# EAGLE design GK_Roland_Breakout (EAGLE 7.6.0)
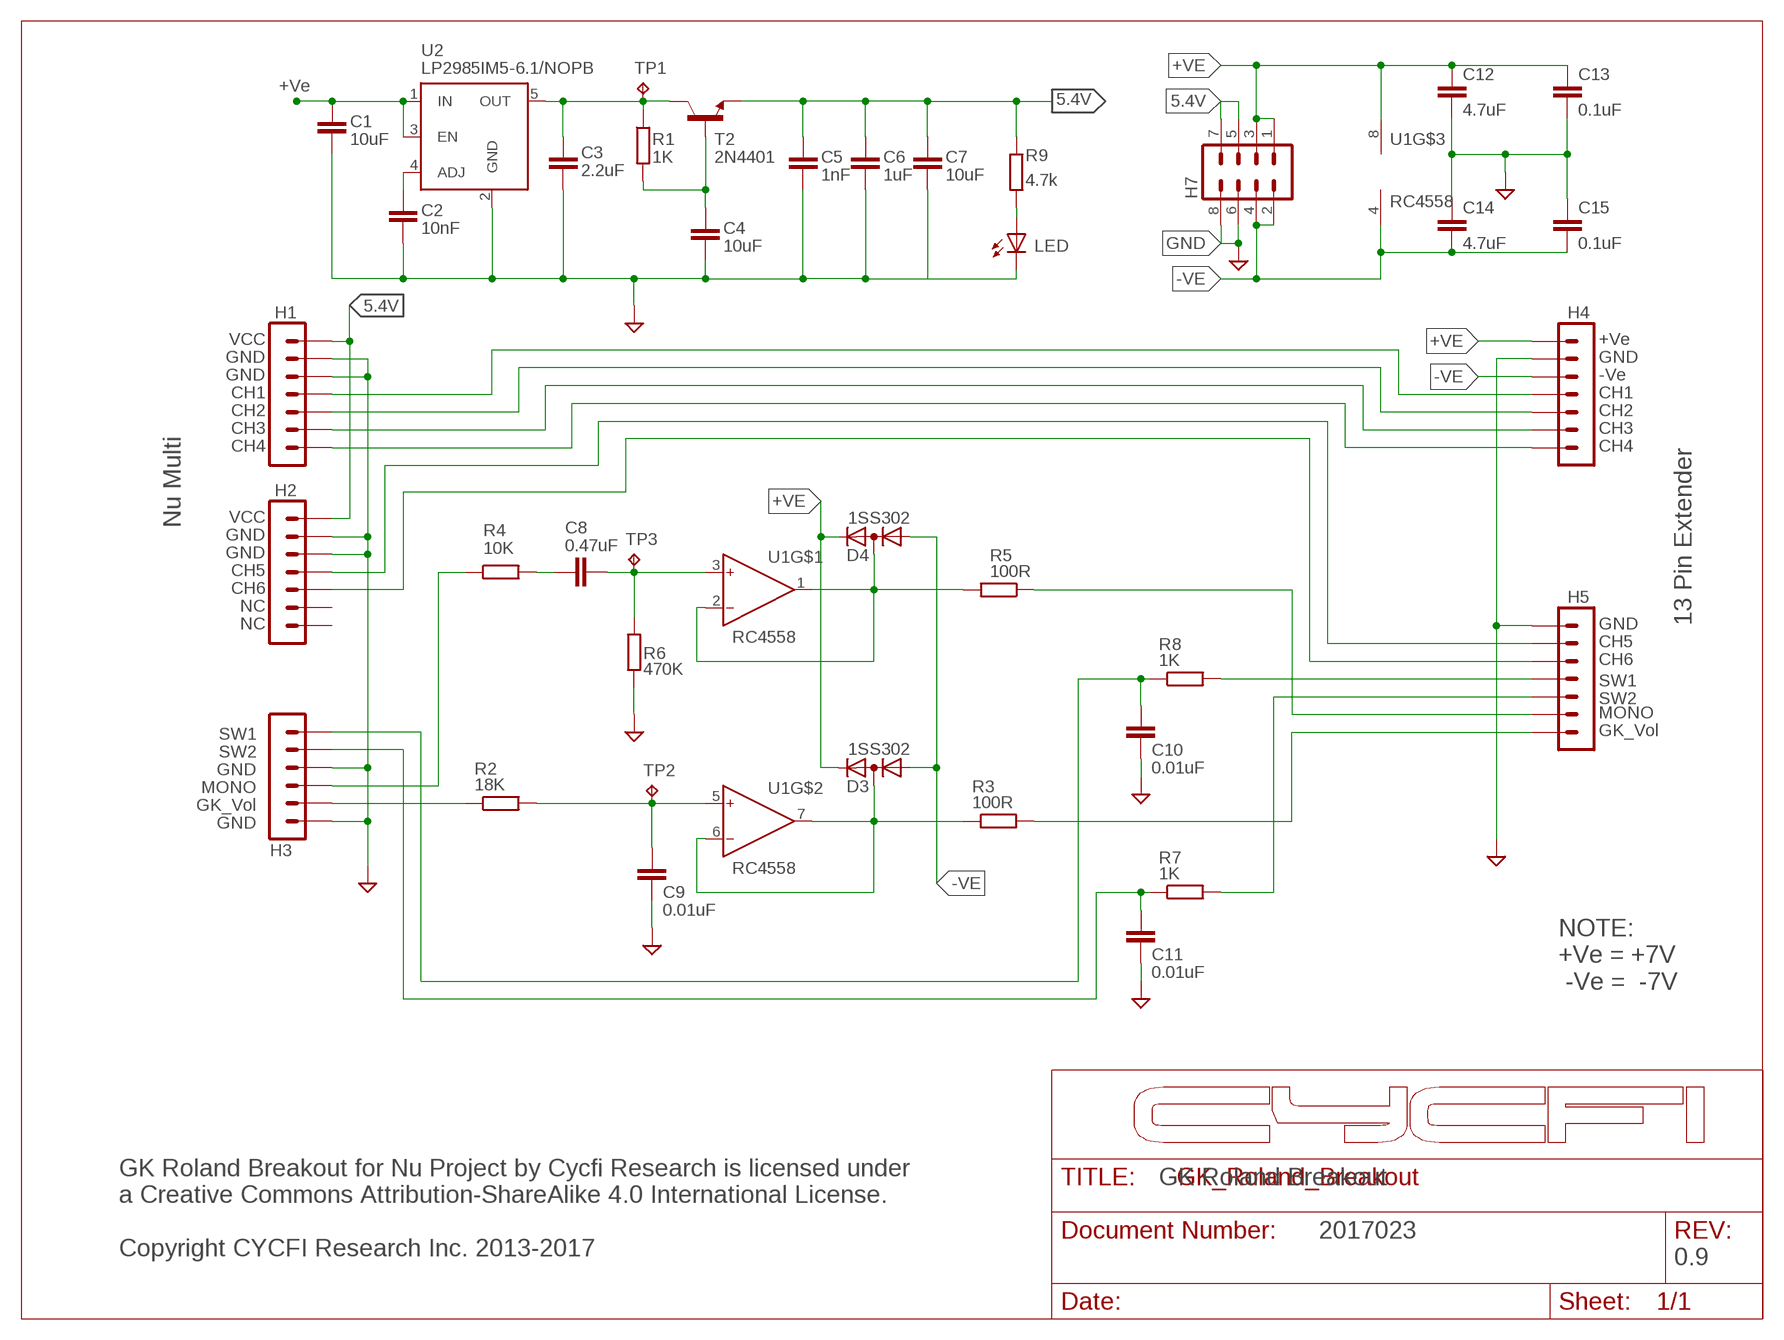
[diagram p0: schematic, sheet 1]

## Parts
C1  10uF  C-EUC0805  [C0805]
C2  10nF  C-EUC0805  [C0805]
C3  2.2uF  C-EUC0805  [C0805]
C4  10uF  C-EUC0805  [C0805]
C5  1nF  C-EUC0603  [C0603]
C6  1uF  C-EUC0603  [C0603]
C7  10uF  C-EUC0805  [C0805]
C8  0.47uF  C-EUC0603  [C0603]
C9  0.01uF  C-EUC0805  [C0805]
C10  0.01uF  C-EUC0805  [C0805]
C11  0.01uF  C-EUC0805  [C0805]
C12  4.7uF  C-EUC0805  [C0805]
C13  0.1uF  C-EUC0805  [C0805]
C14  4.7uF  C-EUC0805  [C0805]
C15  0.1uF  C-EUC0805  [C0805]
D3  1SS302  [SC70-3]
D4  1SS302  [SC70-3]
H1  7P_ZIF_59453-071110EDHLF  [7P_ZIF_59453-071110EDHLF]
H2  7P_ZIF_59453-071110EDHLF  [7P_ZIF_59453-071110EDHLF]
H3  6P-2.54-TH  [6P-2.54-TH]
H4  7P_ZIF_59453-071110EDHLF  [7P_ZIF_59453-071110EDHLF]
H5  7P_ZIF_59453-071110EDHLF  [7P_ZIF_59453-071110EDHLF]
H7  MA04-2  [MA04-2]
LED  LED3MM  [LED3MM]
R1  1K  R-EU_R0402  [R0402]
R2  18K  R-EU_R0402  [R0402]
R3  100R  R-EU_R0402  [R0402]
R4  10K  R-EU_R0402  [R0402]
R5  100R  R-EU_R0402  [R0402]
R6  470K  R-EU_R0402  [R0402]
R7  1K  R-EU_R0402  [R0402]
R8  1K  R-EU_R0402  [R0402]
R9  4.7k  R-EU_R0402  [R0402]
T2  2N4401  TRAN-MMBT2222A  [SOT23-3]
TP1  TPB1,27  [B1,27]
TP2  TPB1,27  [B1,27]
TP3  TPB1,27  [B1,27]
U1  RC4558  [SOIC-8]
U2  MIC5205-5V  MIC5219BM5  [SOT23-5]

## Nets
5.4V: C5.1 C6.1 C7.1 H1.P$1 H2.P$1 H7.5 H7.7 R9.1 T2.2(E)
+VE: C1.1 C12.1 C13.1 D3.2(K) D4.2(K) H4.P$1 H7.1 H7.3 U1.8(V+) U2.1(IN) U2.3(EN)
-VE: C14.2 C15.2 D3.1(A) D4.1(A) H4.P$3 H7.2 H7.4 U1.4(V-)
GND: C1.2 C2.2 C3.2 C4.2 C5.2 C6.2 C7.2 C9.2 C10.2 C11.2 C12.2 C13.2 C14.1 C15.1 H1.P$2 H1.P$3 H2.P$2 H2.P$3 H3.3 H3.6 H4.P$2 H5.P$1 H7.6 H7.8 LED.K(C) R6.2 U2.2(GND)
N$1: C4.1 R1.2 T2.1(B)
N$2: LED.A R9.2
N$3: C2.1 U2.4(ADJ)
N$5: H1.P$4 H4.P$4
N$6: H1.P$5 H4.P$5
N$7: H1.P$6 H4.P$6
N$8: H1.P$7 H4.P$7
N$9: H5.P$6 R5.1
N$10: H2.P$4 H5.P$2
N$11: D3.3(AK) R3.1 U1.6(IN-) U1.7(OUT)
N$12: C9.1 R2.2 TP2.TP U1.5(IN+)
N$13: H5.P$7 R3.2
N$14: C8.2 R4.2
N$15: C8.1 R6.1 TP3.TP U1.3(IN+)
N$16: D4.3(AK) R5.2 U1.1(OUT) U1.2(IN-)
N$18: H2.P$5 H5.P$3
N$19: C10.1 H3.1 R8.1
N$20: C11.1 H3.2 R7.1
N$23: H3.4 R4.1
N$24: H3.5 R2.1
N$25: H5.P$5 R7.2
N$26: H5.P$4 R8.2
NC1: C3.1 R1.1 T2.3(C) TP1.TP U2.5(OUT)
Unconnected: H2.P$6 H2.P$7

## Notes on the sheet
- LP2985IM5-6.1/NOPB
- +Ve
- VCC | +Ve
- GND | GND
- GND | -Ve
- CH1 | CH1
- CH2 | CH2
- CH3 | CH3
- CH4 | CH4
- Nu Multi | VCC
- GND
- GND
- CH5
- CH6
- NC
- NC | GND | 13 Pin Extender
- CH5
- CH6
- SW1
- SW2
- MONO
- SW1
- GK_Vol
- SW2
- GND
- MONO
- GK_Vol
- GND
- NOTE:
  +Ve = +7V
   -Ve =  -7V
- GK Roland Breakout
- 2017023
- GK Roland Breakout for Nu Project by Cycfi Research is licensed under 
  a Creative Commons Attribution-ShareAlike 4.0 International License.
  
  Copyright CYCFI Research Inc. 2013-2017
- 0.9

## Library data of the parts
C1-C15 = resistor:C-EU: CAPACITOR, European symbol
D3 D4 = CYCFI_semicon:1SS302
H1 H2 H4 H5 = CYCFI_Con:7P_ZIF_59453-071110EDHLF
H3 = CYCFI_Con:6P-2.54-TH
H7 = con-lstb:MA04-2: PIN HEADER; OC_FARNELL: unknown; OC_NEWARK: unknown
LED = led:LED: LED OSRAM: - CHIPLED LG R971, LG N971, LY N971, LG Q971, LY Q971, LO R971, LY R971 LH N974, LH R974 LS Q976, LO Q976, LY Q976 LO Q996 - Hyper CHIPLED LW Q18S LB Q993, LB Q99A, LB R99A - SideLED LS A670, LO A670, LY A670, LG A670, LP A670 LB A673, LV A673, LT A673, LW A673 LH A674 LY A675 LS A676, LA A676, LO A676, LY A676, LW A676 LS A679, LY A679, LG A679 - Hyper Micro SIDELED® LS Y876, LA Y876, LO Y876, LY Y876 LT Y87S - SmartLED LW L88C, LW L88S LB L89C, LB L89S, LG L890 LS L89K, LO L89K, LY L89K LS L896, LA L896, LO L896, LY L896 - TOPLED LS T670, LO T670, LY T670, LG T670, LP T670 LSG T670, LSP T670, LSY T670, LOP T670, LYG T670 LG T671, LOG T671, LSG T671 LB T673, LV T673, LT T673, LW T673 LH T674 LS T676, LA T676, LO T676, LY T676, LB T676, LH T676, LSB T676, LW T676 LB T67C, LV T67C, LT T67C, LS T67K, LO T67K, LY T67K, LW E67C LS E67B, LA E67B, LO E67B, LY E67B, LB E67C, LV E67C, LT E67C LW T67C LS T679, LY T679, LG T679 LS T770, LO T770, LY T770, LG T770, LP T770 LB T773, LV T773, LT T773, LW T773 LH T774 LS E675, LA E675, LY E675, LS T675 LS T776, LA T776, LO T776, LY T776, LB T776 LHGB T686 LT T68C, LB T68C - Hyper Mini TOPLED® LB M676 - Mini TOPLED Santana® LG M470 LS M47K, LO M47K, LY M47K Source: http://www.osram.convergy.de LUXEON: - LUMILED® LXK2-PW12-R00, LXK2-PW12-S00, LXK2-PW14-U00, LXK2-PW14-V00 LXK2-PM12-R00, LXK2-PM12-S00, LXK2-PM14-U00 LXK2-PE12-Q00, LXK2-PE12-R00, LXK2-PE12-S00, LXK2-PE14-T00, LXK2-PE14-U00 LXK2-PB12-K00, LXK2-PB12-L00, LXK2-PB12-M00, LXK2-PB14-N00, LXK2-PB14-P00, LXK2-PB14-Q00 LXK2-PR12-L00, LXK2-PR12-M00, LXK2-PR14-Q00, LXK2-PR14-R00 LXK2-PD12-Q00, LXK2-PD12-R00, LXK2-PD12-S00 LXK2-PH12-R00, LXK2-PH12-S00 LXK2-PL12-P00, LXK2-PL12-Q00, LXK2-PL12-R00 Source: www.luxeon.com KINGBRIGHT: KA-3528ASYC Source: www.kingbright.com
R1-R9 = resistor:R-EU_: RESISTOR, European symbol
T2 = Cycfi:TRAN-MMBT2222A
TP1-TP3 = testpad:TP: Test pad
U1 = CYCFI_semicon:RC4558
U2 = v-reg-micrel:MIC5219BM5: VOLTAGE REGULATOR; MF: ALTERA CORPORATION; MPN: MIC5219BM5 TR; OC_FARNELL: 1100656; OC_NEWARK: 09J8939

## Board
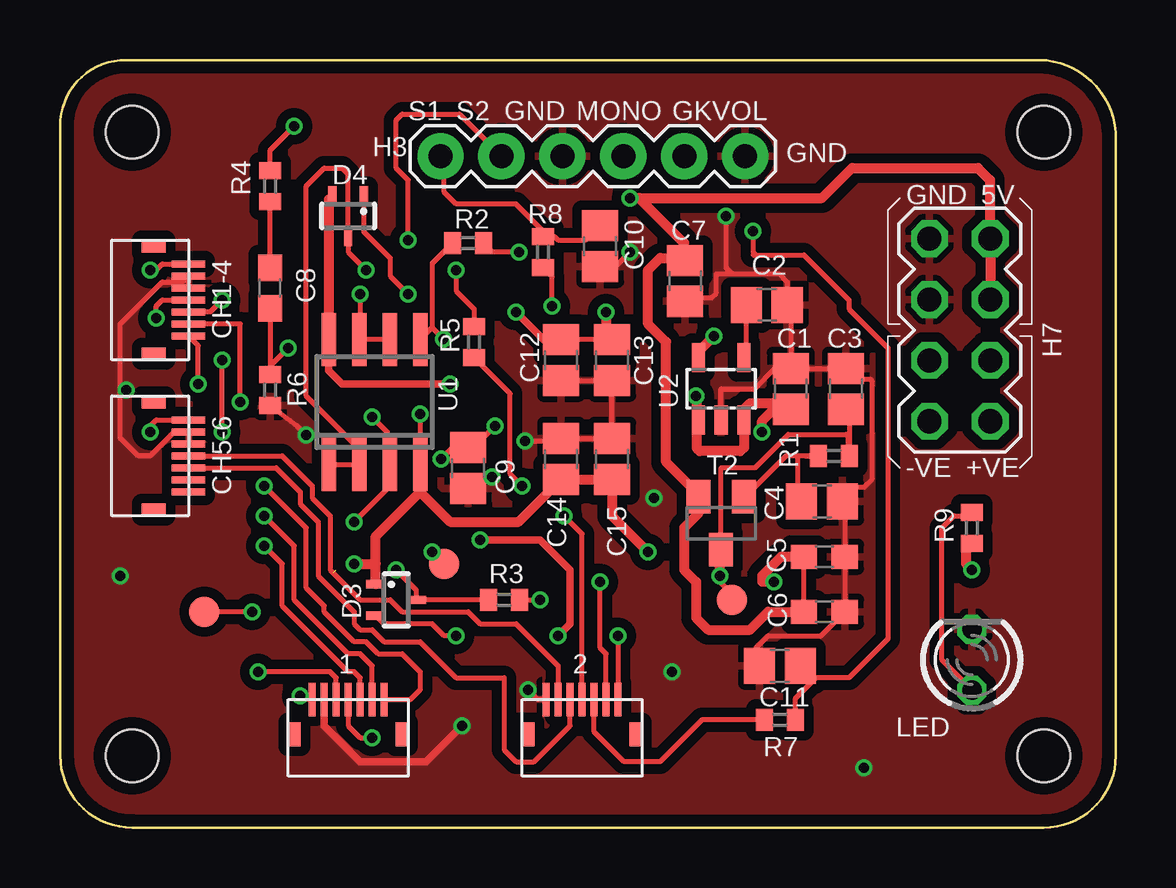
[diagram p1: board, top side]
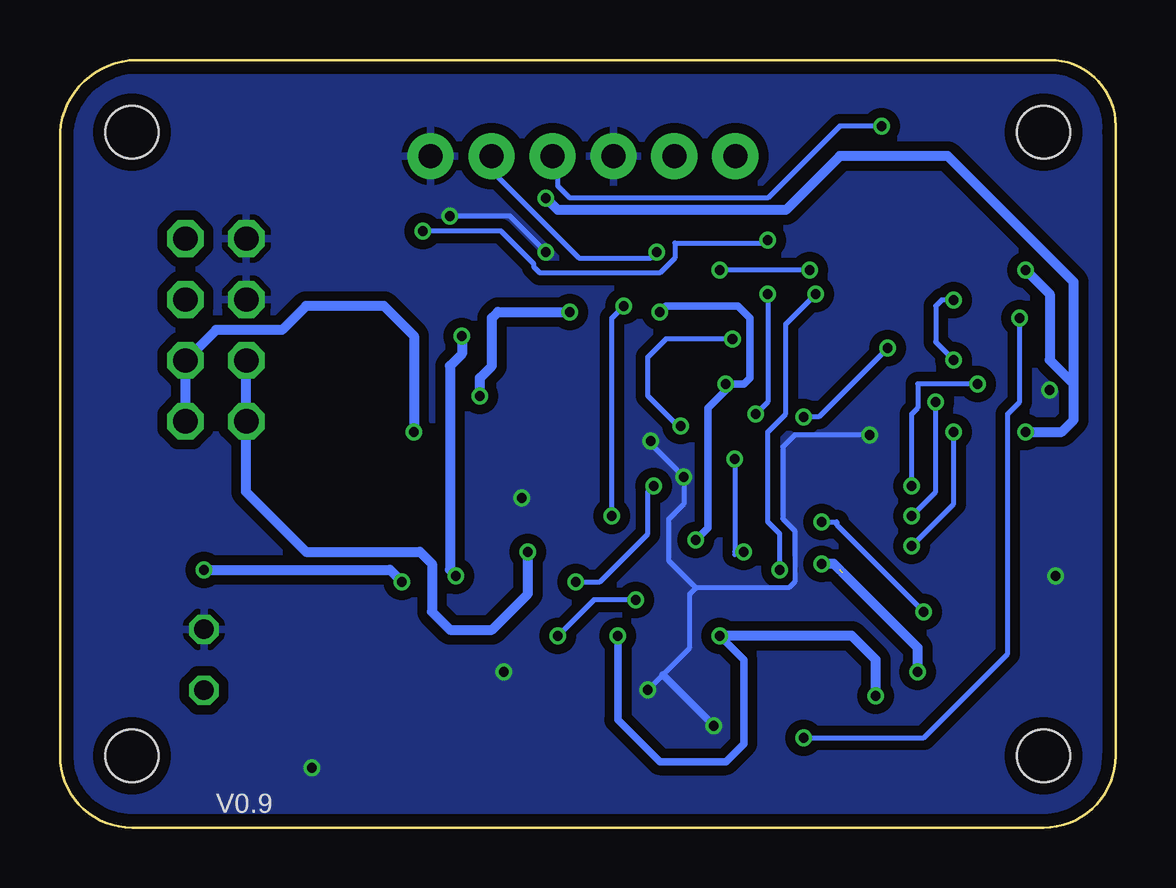
[diagram p2: board, bottom side, seen from below]

Size 44.01 x 32.01 mm. Coordinates in mm from the lower left corner, seen from the top.
Outline: 0.01,29 0.01,3 arc90 3.01,0 41.01,0 arc90 44.01,3 44.01,29 arc90 40.51,32 2.51,32 arc90 0.01,29
Copper layers (1*16): Top 0.035mm / dielectric 1.6mm / Bottom 0.035mm
Design rules "Elecrow_2-layer_PCB_eagle_rule": minimum track width 6mil, minimum drill 12mil, track to track 6mil, track to pad 8mil, pad to pad 12mil, via to via 12mil, smd to smd 0mil, copper to edge 20mil, drill to drill 10mil, minimum pad ring 6mil, minimum via ring 6mil, stop-mask expansion 0mil, vias tented up to drill 100mil, thermal gap 10mil
Holes 2.2 mm at 3.01,29 3.01,3 41.01,3 41.01,29

### Footprints (pad centres in the part's own frame; a part is rotated, then mirrored left to right if it is on the bottom)
C0805 = smd 1.3 x 1.5: 1 -0.85,0; 2 0.85,0
C0603 = smd 1.1 x 1: 1 -0.85,0; 2 0.85,0
SC70-3 = smd 0.35 x 0.8: 1 -0.65,-0.85; 2 0.65,-0.85; 3 0,0.85
7P_ZIF_59453-071110EDHLF = smd 0.3 x 1.4: P$1 -1.5,1.6; P$2 -1,1.6; P$3 -0.5,1.6; P$4 0,1.6; P$5 0.5,1.6; P$6 1,1.6; P$7 1.5,1.6 | smd 0.52 x 1: ST1 -2.24,0.15; ST2 2.24,0.15
6P-2.54-TH = drill 1 pad 1.93: 1 -6.35,0; 2 -3.81,0; 3 -1.27,0; 4 1.27,0; 5 3.81,0; 6 6.35,0
MA04-2 = drill 1.016 octagon: 1 -3.81,-1.27; 2 -3.81,1.27; 3 -1.27,-1.27; 4 -1.27,1.27; 5 1.27,-1.27; 6 1.27,1.27; 7 3.81,-1.27; 8 3.81,1.27
LED3MM = drill 0.813 octagon: A -1.27,0; K 1.27,0
R0402 = smd 0.7 x 0.9: 1 -0.65,0; 2 0.65,0
SOT23-3 = smd 1 x 1.4: 1 -0.95,-1.1; 2 0.95,-1.1; 3 0,1.1
B1,27 = smd 1.27 x 1.27: TP 0,0
SOIC-8 = smd 0.6 x 2.2: 1 -1.905,-2.6; 2 -0.635,-2.6; 3 0.635,-2.6; 4 1.905,-2.6; 5 1.905,2.6; 6 0.635,2.6; 7 -0.635,2.6; 8 -1.905,2.6
SOT23-5 = smd 0.55 x 1.2: 1 -0.95,-1.3; 2 0,-1.3; 3 0.95,-1.3; 4 0.95,1.3; 5 -0.95,1.3

### Placement (x,y rotation side)
C1  30.46,18.3 90 top
C2  29.46,21.8 0 top
C3  32.76,18.3 90 top
C4  31.76,13.6 0 top
C5  31.86,11.3 0 top
C6  31.86,9 0 top
C7  26.06,22.8 270 top
C8  8.76,22.5 90 top
C9  17.01,15 270 top
C10  22.51,24.25 270 top
C11  30.01,6.75 180 top
C12  20.89,19.5 270 top
C13  23.01,19.5 270 top
C14  20.89,15.38 270 top
C15  23.01,15.38 270 top
D3  14.01,9.5 270 top
D4  12.01,25.5 180 top
H1  3.76,22 270 top
H2  3.76,15.5 270 top
H3  22.21,28 0 top
H4  12.01,3.75 0 top
H5  21.76,3.75 0 top
H7  37.51,20.75 90 top
LED  38.01,7 90 top
R1  32.26,15.5 180 top
R2  17.01,24.38 180 top
R3  18.51,9.5 0 top
R4  8.76,26.75 270 top
R5  17.26,20.25 90 top
R6  8.76,18.25 270 top
R7  30.01,4.5 180 top
R8  20.14,24 270 top
R9  38.01,12.5 90 top
T2  27.56,12.7 180 top
TP1  28.01,9.5 0 top
TP2  16.01,11 0 top
TP3  6.01,9 0 top
U1  13.11,17.75 0 top
U2  27.56,18.3 0 top

### Tracks (layer width: path | path; a pad name or v marks a point on that pad's centre or on a via)
5.4V  (via drill 0.4)
  Top 0.203: C6.1 C5.1 30.56,11.3 | v3.76,16.5 3.76,16.75 4.01,17 H2.P$1 | 26.01,24.38 26.01,23.7 C7.1 | 37.76,11.6 R9.1 | v3.76,23.25 4.01,23.25 4.26,23.5 H1.P$1
  Top 0.406: 26.01,24.38 24.14,26.25 v23.76,26.25 31.76,26.25 33.01,27.5 38.26,27.5 38.76,27 38.76,24.58 H7.7 H7.5 | C6.1 29.51,9 28.76,8.25 27.01,8.25 26.51,8.75 26.51,10.25 26.01,10.75 26.01,12.5 26.61,13.1 T2.2 26.61,13.9 25.26,15.25 25.26,20.25 24.51,21 24.51,23.25 25.01,23.75 25.96,23.75 C7.1 | 30.56,11.3 30.06,11.3 29.26,10.5 29.26,10.25 v29.76,10.25 | 37.76,11.6 37.76,11 v38.01,10.75
  Bottom 0.406: v23.76,26.25 23.26,25.75 13.76,25.75 11.51,28 7.01,28 1.76,22.75 1.76,18.5 | v38.01,10.75 30.26,10.75 v29.76,10.25 | v3.76,16.5 2.26,16.5 1.76,17 1.76,18.5 | v3.76,23.25 2.76,22.25 2.76,19.5 1.76,18.5
+VE  (via drill 0.4)
  Top 0.203: 11.21,26.2 D4.2 | 23.24,20.12 C13.1 C12.1 | H4.P$1 10.16,5.35 v10.01,5.5 | D3.2 13.51,8.5 15.51,8.5 16.01,8 v16.51,8
  Top 0.305: U1.8 11.21,19.05 11.76,18.5 v16.26,18.5 | v19.01,21.5 20.26,20.25 20.79,20.25 C12.1 | v17.51,12 20.01,12 21.26,10.75 21.26,8.5 v20.76,8
  Top 0.406: 26.56,16.95 26.56,15.8 26.66,15.7 28.36,15.7 28.51,15.85 U2.3 28.51,17.45 28.76,17.7 30.01,17.7 | 26.56,16.95 U2.1 | 30.01,17.7 30.21,17.7 C1.1 | 11.21,26.2 U1.8 | v29.26,16.5 29.26,16.95 30.01,17.7 | 26.56,16.95 26.56,17.95 v26.51,18 | v22.76,21.5 22.76,20.6 C13.1
  Bottom 0.305: v19.01,21.5 18.76,21.75 15.76,21.75 15.26,21.25 15.26,18.75 15.51,18.5 v16.26,18.5 16.26,18.25 17.01,17.5 17.01,12.5 v17.51,12 | v20.76,8 20.76,4.5 19.01,2.75 16.26,2.75 15.51,3.5 15.51,7 v16.51,8
  Bottom 0.406: v29.26,16.5 29.26,20.5 30.51,21.75 33.76,21.75 34.76,20.75 37.51,20.75 H7.3 H7.1 | v10.01,5.5 10.01,7 11.01,8 v16.51,8 | v22.76,21.5 25.76,21.5 26.01,21.25 26.01,19.25 26.51,18.75 v26.51,18
-VE  (via drill 0.4)  (1 unrouted)
  Top 0.203: D4.1 12.66,24.85 13.76,23.75 13.76,23 v14.51,22.25 | v15.01,17.25 U1.4 | U1.4 | D3.1 12.86,10.15 | H4.P$3 11.51,6.25 11.26,6.5 v8.26,6.5 | U1.4
  Top 0.406: v24.51,11.5 23.01,13 C15.2 C14.2 19.11,12.75 16.26,12.75 15.01,14 | D3.1 13.16,11 | 13.16,11 13.16,12.15 15.01,14 | 15.01,14 U1.4 | v12.26,11 13.16,11
  Bottom 0.203: v14.51,22.25 14.51,17.75 v15.01,17.25
  Bottom 0.406: v8.26,6.5 8.26,7.5 11.39,10.62 | H7.4 H7.2 36.24,14 36.26,14 33.76,11.5 29.01,11.5 28.51,11 28.51,9 27.76,8.25 26.01,8.25 24.51,9.75 v24.51,11.5 | 11.51,10.75 11.76,11 v12.26,11
GND  (via drill 0.4)
  Top 0.203: U2.2 27.56,18.3 28.96,18.3 29.81,19.15 C1.2 | C1.2 30.46,21.65 C2.2 30.31,22.75 29.96,23.1 28.01,23.1 | C1.2 C3.2 33.21,18.7 33.76,18.7 33.86,18.6 33.86,14.55 33.51,14.2 33.21,14.2 C4.2 32.71,13.5 C5.2 C6.2 31.71,8 29.51,8 29.01,7.5 C11.2 | C7.2 26.21,22.1 27.16,22.1 27.36,22.3 27.36,23.1 28.01,23.1 | C10.2 23.01,23.25 v23.76,24 23.89,23.88 | v27.76,25.5 27.76,23.35 28.01,23.1 | C9.2 17.76,14.75 17.89,14.75 v18.01,14.62 | R6.2 9.89,16.75 v10.26,16.38 | v19.39,16.12 20.79,16.12 C14.1 C15.1 C13.2 C12.2 | H1.P$3 H1.P$2 5.11,22.75 4.26,22.75 2.51,21 2.51,16.25 3.26,15.5 3.76,15.5 4.76,16.5 H2.P$2 H2.P$3 | H5.P$1 19.91,5.35 v19.51,5.75
  Top 0.305: H4.P$2 11.01,4.25 12.51,2.75 15.26,2.75 v16.76,4.25
  Bottom 0.203: v23.76,24 25.26,25.5 v27.76,25.5 | v10.26,16.38 13.39,16.38 13.89,15.88 13.89,12.88 13.39,12.38 13.39,10.25 13.64,10 17.51,10 | 17.51,10 18.64,11.12 18.64,12.88 18.01,13.5 v18.01,14.62 19.39,16 v19.39,16.12 | v19.51,5.75 18.89,6.38 17.76,7.5 17.76,9.75 17.51,10
  Bottom 0.305: v16.76,4.25 18.89,6.38
  other vias: 25.51,6.5 33.51,2.5 24.76,13.75 2.76,18.25 2.51,10.5
  pour Top (isolate 0.406): 0.01,32 0.01,0 44.01,0 44.01,32
  pour Bottom (isolate 0.406): 0.01,32 0.01,0 44.01,0 44.01,32
N$1
  Top 0.203: C4.1 30.76,13.75 30.76,15.5 | 31.06,15.5 R1.2 30.76,15.5 | 30.76,15.5 30.26,15.5 28.56,13.8 T2.1
N$2
  Top 0.203: LED.A 38.01,5.75 36.76,7 36.76,12.5 37.26,13 37.86,13 R9.2
N$3
  Top 0.203: U2.4 28.61,19.7 C2.1
N$5  (via drill 0.4)
  Top 0.203: H4.P$4 12.01,4.25 12.51,3.75 v13.01,3.75 | v4.01,21.25 4.01,21.75 4.26,22 H1.P$4
  Bottom 0.203: v13.01,3.75 8.01,3.75 4.51,7.25 4.51,17.25 4.01,17.75 v4.01,21.25
N$6  (via drill 0.4)
  Top 0.203: H4.P$5 12.51,6.25 12.26,6.5 12.01,6.5 9.26,9.25 9.26,11 v8.51,11.75 | v6.76,16.5 v6.76,19.5 | v6.76,22 6.26,21.5 H1.P$5
  Bottom 0.203: v8.51,11.75 6.76,13.5 v6.76,16.5 | v6.76,19.5 7.51,20.25 7.51,21.75 7.26,22 v6.76,22
N$7  (via drill 0.4)
  Top 0.203: v8.51,13 9.76,11.75 9.76,9.5 12.01,7.25 12.51,7.25 13.01,6.75 H4.P$6 | v7.51,17.75 7.51,21 H1.P$6
  Bottom 0.203: v8.51,13 7.51,14 v7.51,17.75
N$8  (via drill 0.4)
  Top 0.203: v8.51,14.25 10.26,12.5 10.26,10 11.01,9.25 11.01,9 12.26,7.75 12.76,7.75 13.26,7.25 14.26,7.25 15.01,6.5 15.01,5.75 14.61,5.35 H4.P$7 | v5.76,18.5 5.76,20.1 H1.P$7
  Bottom 0.203: v8.51,14.25 8.51,17.25 8.26,17.5 8.26,18.5 v5.76,18.5
N$9  (via drill 0.4)
  Top 0.203: H5.P$6 22.76,7.25 22.51,7.5 v22.51,10.25 | v19.26,14.25 18.76,14.75 18.76,18.1 R5.1
  Bottom 0.203: v22.51,10.25 21.51,10.25 19.51,12.25 19.51,14 v19.26,14.25
N$10
  Top 0.203: H2.P$4 9.26,15.5 10.51,14.25 10.51,13.75 11.26,13 11.26,10.75 12.51,9.5 13.76,9.5 14.26,9 17.01,9 17.51,8.5 19.01,8.5 20.76,6.75 H5.P$2
N$11  (via drill 0.4)
  Top 0.203: v14.01,10.75 14.86,9.9 D3.3 R3.1 | v12.51,22.25 12.51,20.39 U1.7 U1.6
  Bottom 0.203: v14.01,10.75 14.01,12.25 14.51,12.75 14.51,16.5 13.76,17.25 13.76,21 v12.51,22.25
N$12  (via drill 0.4)
  Top 0.203: 15.51,20.84 15.51,23.52 R2.2 | 15.51,20.84 U1.5 | v18.14,16.75 17.39,16 C9.1 16.51,16 v15.89,15.38 | v15.98,20.38 15.51,20.84 | TP2.TP v15.51,11.5
  Bottom 0.203: v18.14,16.75 18.26,16.75 19.51,18 19.51,19.62 18.76,20.38 v15.98,20.38 | v15.89,15.38 15.89,11.5 | 15.89,11.5 15.89,11.38 | v15.51,11.5 15.89,11.5
N$13  (via drill 0.4)
  Top 0.203: R3.2 v20.01,9.5 | v23.26,8 H5.P$7
  Bottom 0.203: v20.01,9.5 21.76,9.5 v23.26,8
N$14
  Top 0.203: C8.2 R4.2
N$15  (via drill 0.4)
  Top 0.203: C8.1 R6.1 8.76,19.25 v9.51,20 | v12.26,12.75 13.75,14.23 U1.3 13.64,15.26 13.64,16.5 v13.01,17.12 | v8.01,9 TP3.TP
  Bottom 0.203: v12.26,12.75 11.64,12.75 11.64,12.62 v8.01,9 | v9.51,20 12.39,17.12 v13.01,17.12
N$16  (via drill 0.4)
  Top 0.203: v12.76,23.25 12.01,24 D4.3 12.01,27.25 11.76,27.5 11.01,27.5 10.26,26.75 10.26,18 12.48,15.79 U1.2 U1.1 | v16.51,23.25 16.51,22.38 17.26,21.62 R5.2
  Bottom 0.203: v12.76,23.25 v16.51,23.25
N$18
  Top 0.203: H2.P$5 9.01,15 10.01,14 10.01,13.5 10.76,12.75 10.76,10.5 12.26,9 12.26,8.5 12.51,8.25 13.01,8.25 13.51,7.75 15.01,7.75 16.51,6.25 18.51,6.25 18.51,3.25 19.01,2.75 19.76,2.75 21.26,4.25 H5.P$3
N$19
  Top 0.203: C10.1 21.91,24.5 20.76,24.5 20.61,24.65 R8.1 20.14,24.88 19.01,26 16.51,26 16.01,26.5 16.01,27.85 H3.1
N$20  (via drill 0.4)
  Top 0.203: 31.51,6.25 C11.1 | 28.89,23.88 29.01,23.88 | 29.01,23.88 31.01,23.88 32.89,22 32.89,21.62 34.51,20 34.51,7.88 32.89,6.25 31.51,6.25 | v28.89,24.88 28.89,24 29.01,23.88 | R7.1 30.66,5.4 31.51,6.25 | v14.51,24.5 14.51,27 14.01,27.5 14.01,29.5 14.26,29.75 16.65,29.75 H3.2
  Bottom 0.203: v28.89,24.88 25.64,24.88 24.26,23.5 24.26,23.38 24.01,23.12 19.01,23.12 18.39,23.75 18.39,24.38 14.64,24.38 v14.51,24.5
N$23  (via drill 0.4)
  Top 0.203: R4.1 8.76,28.25 v9.76,29.25
  Bottom 0.203: v9.76,29.25 11.51,29.25 14.51,26.25 22.76,26.25 23.26,26.75 23.26,27.78 H3.4
N$24  (via drill 0.4)
  Top 0.203: v19.14,24 18.04,24 R2.1
  Bottom 0.203: v19.14,24 19.39,23.75 22.39,23.75 26.14,27.5 26.14,27.89 H3.5
N$25
  Top 0.203: R7.2 26.76,4.5 25.01,2.75 23.51,2.75 22.26,4 H5.P$5
N$26  (via drill 0.4)
  Top 0.203: H5.P$4 21.76,12.25 v21.01,13 | v20.51,21.75 20.51,22.98 R8.2
  Bottom 0.203: v21.01,13 21.01,21.25 v20.51,21.75
NC1  (via drill 0.4)
  Top 0.203: C3.1 32.91,17.3 R1.1 32.86,15.55 32.86,16.3 32.76,16.4 30.36,16.4 28.96,15 27.56,15 T2.3 | TP1.TP 28.01,9.75 27.51,10.25 v27.51,10.5
  Top 0.406: U2.5 26.61,19.85 v27.26,20.5 | v27.51,10.5 27.51,11.55 T2.3
  Bottom 0.406: v27.26,20.5 27.26,19.75 27.76,19.25 27.76,10.75 v27.51,10.5

### Text on the board
tNames: S1 | S2 | GND | MONO | GKVOL | GND | GND | 5V | CH1-4 | -VE | +VE | CH5-6 | 1 | 2
bNames: V0.9